# Altium schematic sheet TCAN1146_PWR_MGMT.SchDoc
size C; SheetNumber: 5; SheetTotal: 7
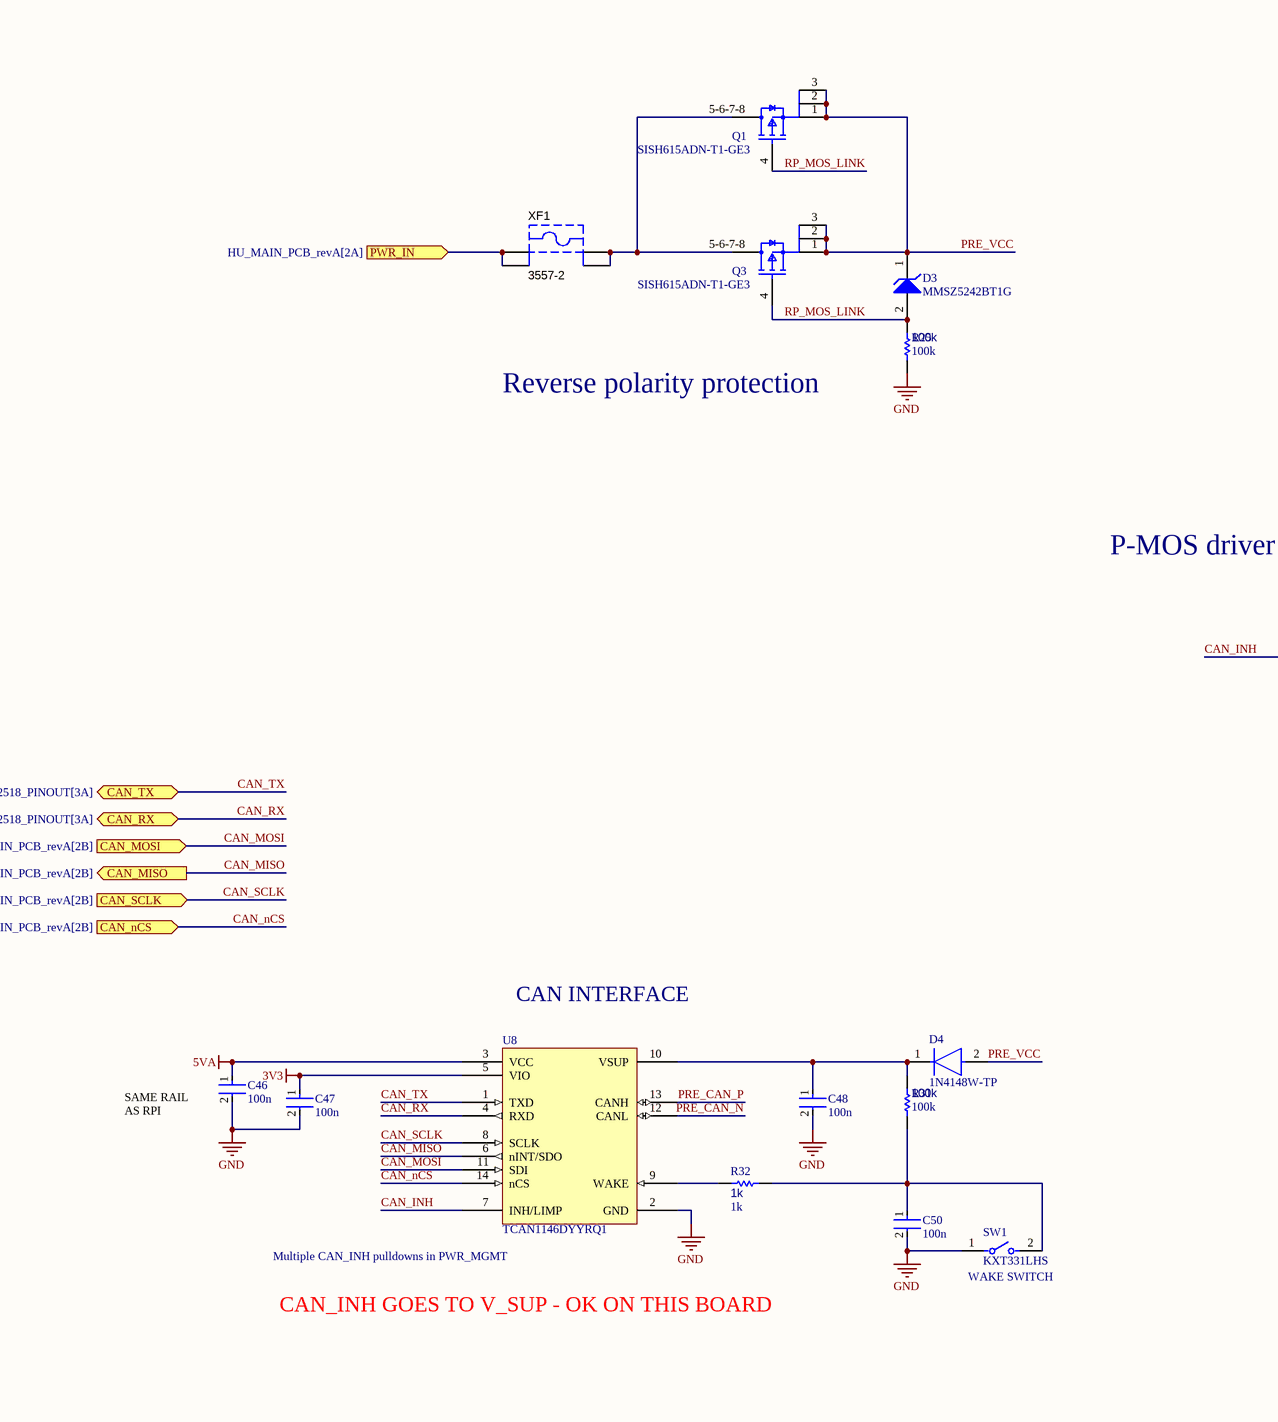
[diagram p0: TCAN1146_PWR_MGMT.SchDoc, left]
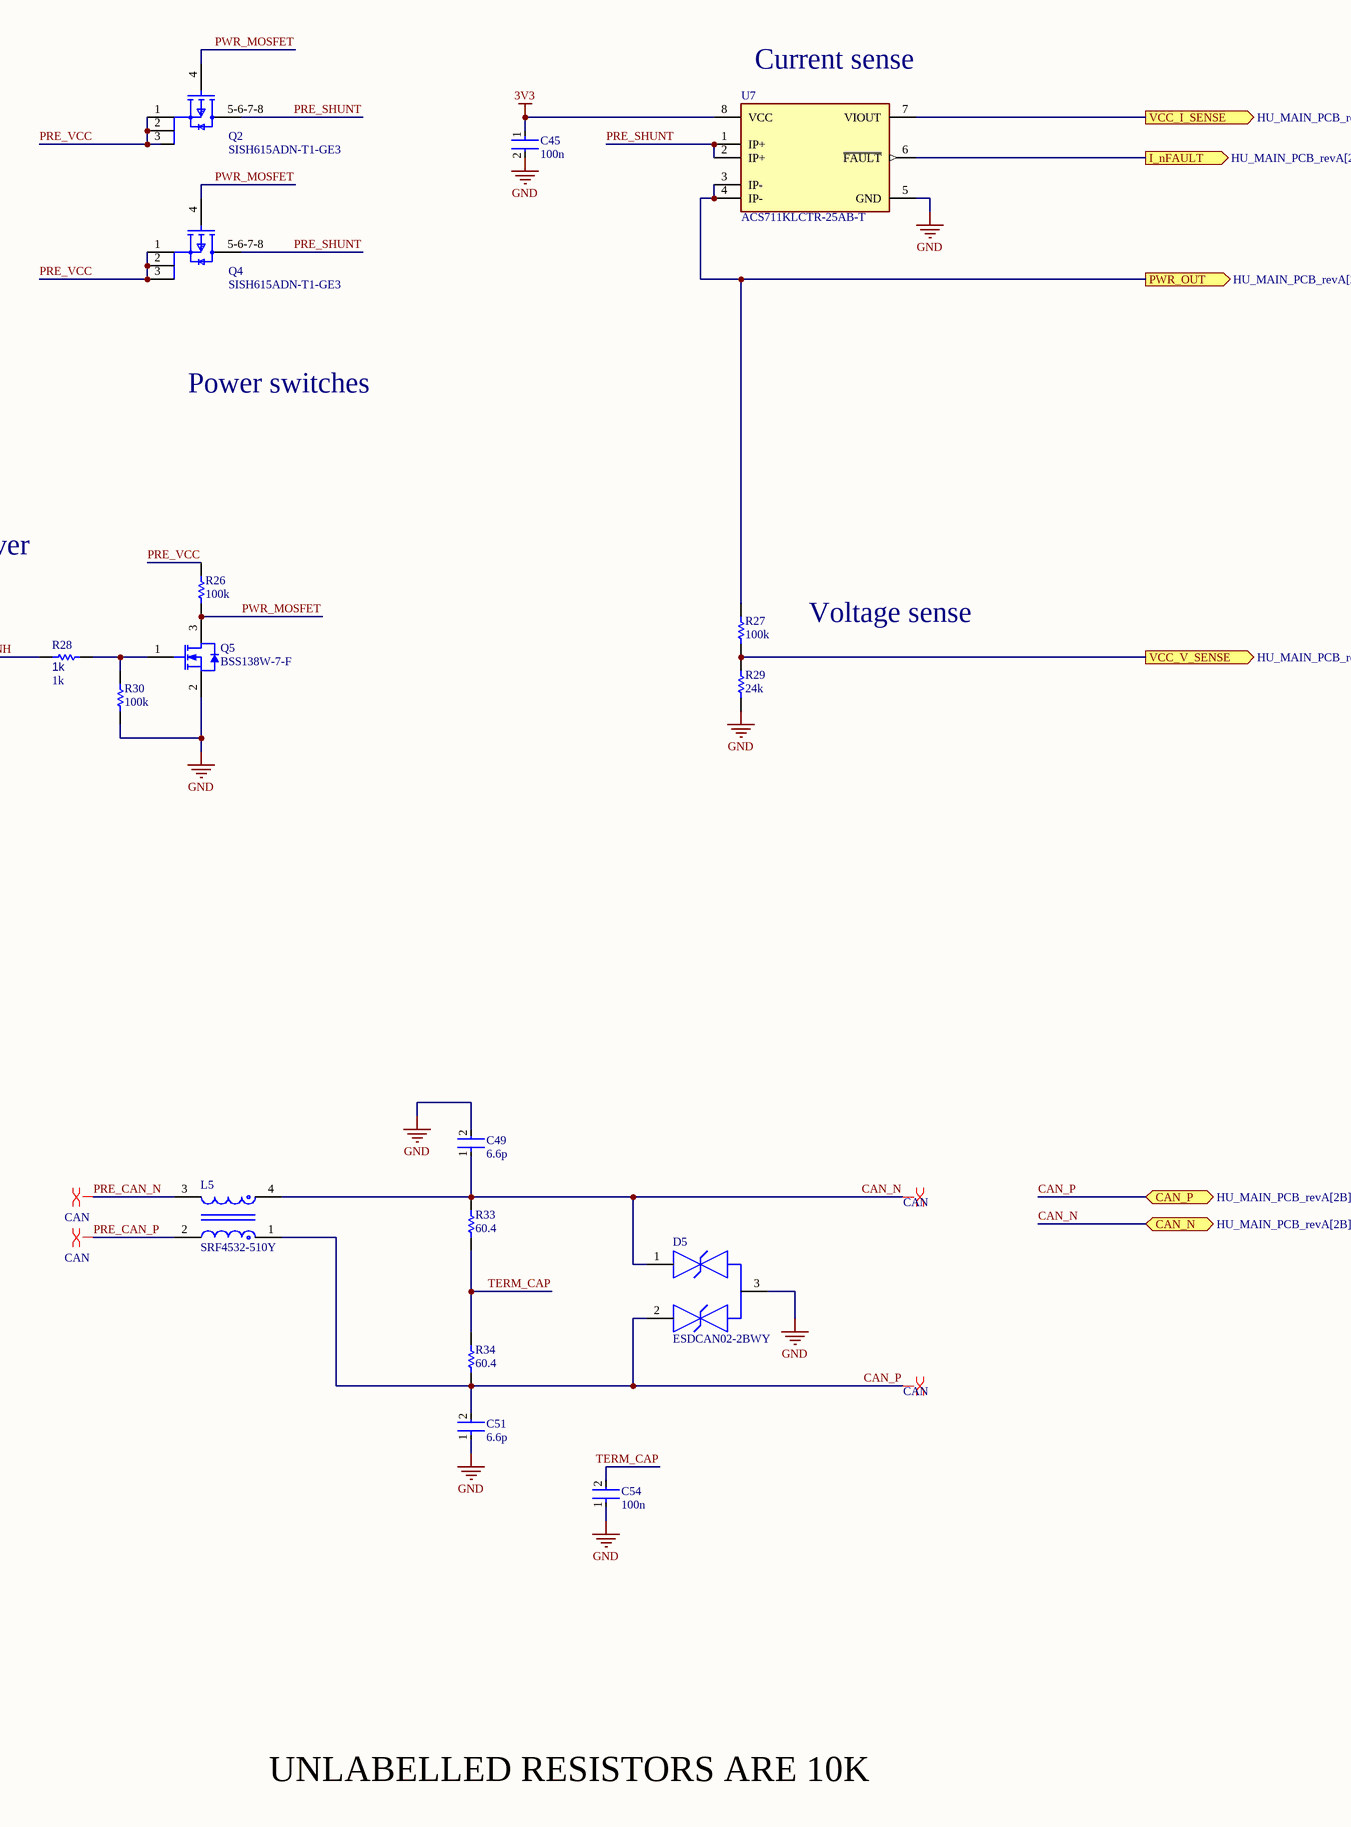
[diagram p1: TCAN1146_PWR_MGMT.SchDoc, right]

## Parts
C45  100n  [FP-0402-L_1_0_0_05-W_0_5-IPC_A]
C46  100n  [FP-0402-L_1_0_0_05-W_0_5-IPC_A]
C47  100n  [FP-0402-L_1_0_0_05-W_0_5-IPC_A]
C48  100n  [FP-0402-L_1_0_0_05-W_0_5-IPC_A]
C49  6.6p  [FP-0402-L_1_0_0_05-W_0_5-IPC_A]
C50  100n  [FP-0402-L_1_0_0_05-W_0_5-IPC_A]
C51  6.6p  [FP-0402-L_1_0_0_05-W_0_5-IPC_A]
C54  100n  [FP-0402-L_1_0_0_05-W_0_5-IPC_A]
D3  MMSZ5242BT1G  [ONSC-SOD-123-2-425-04_V]
D4  1N4148W-TP  [FP-SOD-123-IPC_A]
D5  ESDCAN02-2BWY  [FP-SOT323-3L-MFG]
L5  SRF4532-510Y  [FP-SRF4532-MFG]
Q1  SISH615ADN-T1-GE3  [SISH615ADN-T1-GE3-Footprint-1]
Q2  SISH615ADN-T1-GE3  [SISH615ADN-T1-GE3-Footprint-1]
Q3  SISH615ADN-T1-GE3  [SISH615ADN-T1-GE3-Footprint-1]
Q4  SISH615ADN-T1-GE3  [SISH615ADN-T1-GE3-Footprint-1]
Q5  BSS138W-7-F  [DIOD-SOT323-3_V]
R25  100k  [R0603B]
R26  100k  [R0603B]
R27  100k  [R0603B]
R28  1k  [R0603B]
R29  24k  [R0603B]
R30  100k  [R0603B]
R31  100k  [R0603B]
R32  1k  [R0603B]
R33  60.4  [R0603B]
R34  60.4  [R0603B]
SW1  KXT331LHS  [FP-KXT331LHS-MFG]
U7  ACS711KLCTR-25AB-T  [FP-LC-8-IPC_A]
U8  TCAN1146DYYRQ1  [TCAN1146DYYRQ1-Footprint-1]
XF1  3557-2  [KSTN-3557-2]

## Ports
CAN_MISO (out, see HU_MAIN_PCB_revA[2B]), CAN_MOSI (in, see HU_MAIN_PCB_revA[2B]), CAN_N (bidir, see HU_MAIN_PCB_revA[2B]), CAN_nCS (in, see HU_MAIN_PCB_revA[2B]), CAN_P (bidir, see HU_MAIN_PCB_revA[2B]), CAN_RX (bidir, see HU_MAIN_PCB_revA[2B], MCP2518_PINOUT[3A]), CAN_SCLK (in, see HU_MAIN_PCB_revA[2B]), CAN_TX (bidir, see HU_MAIN_PCB_revA[2B], MCP2518_PINOUT[3A]), I_nFAULT (out, see HU_MAIN_PCB_revA[2B]), PWR_IN (in, see HU_MAIN_PCB_revA[2A]), PWR_OUT (out, see HU_MAIN_PCB_revA[2A]), VCC_I_SENSE (out, see HU_MAIN_PCB_revA[2B]), VCC_V_SENSE (out, see HU_MAIN_PCB_revA[2B])

## Nets
3V3: C45.1 C47.1 U7.8(VCC) U8.5(VIO)
5VA: C46.1 U8.3(VCC)
GND: C45.2 C46.2 C47.2 C48.2 C49.2 C50.2 C51.1 C54.1 D5.3 Q5.2(S) R25.1 R29.1 R30.1 SW1.1 U7.5(GND) U8.2(GND)
CAN_INH: R28.1 U8.7(INH/LIMP)
CAN_MISO: U8.6(nINT/SDO) ; port CAN_MISO
CAN_MOSI: U8.11(SDI) ; port CAN_MOSI
CAN_N: C49.1 D5.1 L5.4 R33.2 ; port CAN_N
CAN_nCS: U8.14(nCS) ; port CAN_nCS
CAN_P: C51.2 D5.2 L5.1 R34.1 ; port CAN_P
CAN_RX: U8.4(RXD) ; port CAN_RX
CAN_SCLK: U8.8(SCLK) ; port CAN_SCLK
CAN_TX: U8.1(TXD) ; port CAN_TX
I_nFAULT: U7.6(~{FAULT}) ; port I_nFAULT
PRE_CAN_N: L5.3 U8.12(CANL)
PRE_CAN_P: L5.2 U8.13(CANH)
PRE_SHUNT: Q2.5-6-7-8(D) Q4.5-6-7-8(D) U7.1(IP+) U7.2(IP+)
PRE_VCC: D3.1(K) D4.2(A) Q1.1(S) Q1.2(S) Q1.3(S) Q2.1(S) Q2.2(S) Q2.3(S) Q3.1(S) Q3.2(S) Q3.3(S) Q4.1(S) Q4.2(S) Q4.3(S) R26.2
PWR_IN: XF1.1 XF1.2 ; port PWR_IN
PWR_MOSFET: Q2.4(G) Q4.4(G) Q5.3(D) R26.1
PWR_OUT: R27.2 U7.3(IP-) U7.4(IP-) ; port PWR_OUT
RP_MOS_LINK: D3.2(A) Q1.4(G) Q3.4(G) R25.2
TERM_CAP: C54.2 R33.1 R34.2
VCC_I_SENSE: U7.7(VIOUT) ; port VCC_I_SENSE
VCC_V_SENSE: R27.1 R29.2 ; port VCC_V_SENSE
NetC48_1: C48.1 D4.1(C) R31.2 U8.10(VSUP)
NetC50_1: C50.1 R31.1 R32.2 SW1.2
NetQ1_5-6-7-8: Q1.5-6-7-8(D) Q3.5-6-7-8(D) XF1.3 XF1.4
NetQ5_1: Q5.1(G) R28.2 R30.2
NetR32_1: R32.1 U8.9(WAKE)

## Layout directives
differential pair; differential pair class CAN: CAN_N, CAN_P, PRE_CAN_N, PRE_CAN_P

## Notes on the sheet
- (near U7) Current sense
- (near R25) Reverse polarity protection
- Power switches
- P-MOS driver
- Voltage sense
- CAN INTERFACE
- (near C46) SAME RAIL AS RPI
- (near U8) Multiple CAN_INH pulldowns in PWR_MGMT
- (near SW1) WAKE SWITCH
- CAN_INH GOES TO V_SUP - OK ON THIS BOARD
- UNLABELLED RESISTORS ARE 10K

## Library data of the parts
C45-C51 C54 = CMP-001-00058-1: LARGE PADS, 0402 CAP, CHANGE COMMENT TO MATCH REAL P/N; Capacitor Type: Ceramic; Min Operating Temperature: -55°C; Mounting Technology: Surface Mount; Pins: 2; Case/Package: 0402; RoHS Compliant: Yes; Max Operating Temperature: 85°C
D3 = CMP-1060-00565-1: Zener Voltage Regulator, 500 mW, 2-Pin SOD-123, Pb-Free, Tape and Reel; Manufacturer: On Semiconductor; P Max (W): 0.5; VZ Typ (V): 12; PartNumber: MMSZ5242BT1G; PackageReference: SOD-123-2-425-04; ComponentLink3URL: http://www.onsemi.com/pub_link/Collateral/425-04.PDF; Mounting Technology: Surface Mount; ComponentLink2Description: Datasheet; ComponentLink1URL: http://www.onsemi.com/; ComponentLink3Description: Package Specification; PackageDescription: 2-Pin SOD, Body 1.6 x 2.69 mm; PackageVersion: Rev. G, 10/2009; ComponentLink1Description: Manufacturer URL; RoHS: Pb-Free; ComponentLink2URL: http://www.onsemi.com/pub_link/Collateral/MMSZ5221BT1-D.PDF; Packing: Tape and Reel; DatasheetVersion: Rev. 12
D4 = CMP-2000-04993-2: DIODE GEN PURP 100V 150MA SOD123; Max Reverse Leakage Current: 5uA; Max Surge Current: 2A; Reverse Recovery Time: 4ns; Polarity: Standard; Capacitance: 4pF; Max Forward Surge Current (Ifsm): 1A; Element Configuration: Single; Power Dissipation: 400mW; Forward Voltage: 1V; Radiation Hardening: No; Lead Free: Lead Free; Max Reverse Voltage (DC): 100V; Current Rating: 150mA; Forward Current: 150mA; Packaging: Tape and Reel; Number of Pins: 2; Package Quantity: 3000; Max Operating Temperature: 150°C; Min Operating Temperature: -65°C; Average Rectified Current: 150mA; Recovery Time: 4ns; Output Current: 150mA; Peak Non-Repetitive Surge Current: 2A; Width: 1.8mm; Voltage Rating (DC): 100V; Height: 1.2mm; Max Repetitive Reverse Voltage (Vrrm): 100V; Mount: Surface Mount; Length: 2.85mm
D5 = CMP-12225-000055-1: TVS DIODE 26.5V 44V SOT323-3; Manufacturer: STMicroelectronics; Value: 3pF; Direction: Bidirectional; Breakdown Voltage: 28.5V; Automotive Grade: Grade 0; Standoff Height: 0mm; Peak Pulse Power: 170W; Peak Pulse Current: 3A; Number Of Channels: 2; Max Junction Temp: +175°C; Mouser Description: TVS Diodes / ESD Suppressors Automotive dual-line Transil, Transient voltage suppressor (TVS) for CAN bus; Height: 1.1mm; Category: Diode; Reverse Standoff Voltage: 26.5V; Device Class L1: Circuit Protection; Temperature: -55°C to +175°C; RoHS: TRUE; ComponentLink2URL: https://www.st.com/resource/en/datasheet/esdcan02-2bwy.pdf; Device Class L3: unset; Device Class L2: TVS Diodes; Temperature Range High: +175°C; Octopart: https://octopart.com/esdcan02-2bwy-stmicroelectronics-58631133; Ipc Land Pattern Name: SOT65P210X95-3; Temperature Range Low: -55°C; Capacitance: 3pF; Digikey Description: TVS DIODE 26.5V 44V SOT323-3; Automotive: Yes; ComponentLink2Description: Datasheet; Clamping Voltage: 44V; Manufacturer Part Number: ESDCAN02-2BWY; Lead Free: Yes; Package: SOT323-3L
L5 = CMP-07251-000006-1: CMC 51UH 200MA 2LN 2KOHM SMD; Element Configuration: Dual; Number of Lines: 2; Core Material: Ferrite; Impedance: 2kR; Test Frequency: 100kHz; Voltage Rating (DC): 50V; Insulation Resistance: 10MR; Material: Steel; Tolerance: 50%; DC Resistance (DCR): 3.5R; RoHS Compliant: Yes; Mount: Surface Mount; REACH SVHC: No SVHC; Termination: SMD/SMT; DC Current: 200mA; Current: 200mA; Lead Free: Lead Free; Contact Plating: Tin; Length: 4.5mm; Max DC Current: 200mA; Width: 0.126inch; Case/Package: 4532; Packaging: Tape and Reel; Package Quantity: 1; Min Operating Temperature: -40°C; Depth: 3.4mm; Series: SRF4532; Max Operating Temperature: 125°C; Current Rating: 200mA; Self Resonant Frequency: 100kHz; Height: 0.118inch; Inductance: 51uH; Resistance: 2kR
Q1-Q4 = CMP-013-00018-2: Trans MOSFET P-CH 20V 22.1A 8-Pin PowerPAK 1212 EP T/R; Source: SISH615ADN-T1-GE3.SchLib; Design Item ID: CMP-013-00036-4; Component Type: Standard; Pins: 5
Q5 = CMP-2000-05968-1: N-Channel Enhancement Mode Mosfet, 50 V, 200 mA, -55 to 150 degC, 6-Pin SOT-323, RoHS, Tape and Reel; Typical Turn-Off Delay Time: 20ns; Number of Channels: 1Channel; Type: EnhancementModeFieldEffectTransistor; Brand: DiodesIncorporated; Vds - Drain-Source Breakdown Voltage: 75V; Vgs - Gate-Source Voltage: 20V; Rds On - Drain-Source Resistance: 1.4Ohms; Transistor Type: 1N-Channel; Configuration: Single; Unit Weight: 0.000212oz; Pd - Power Dissipation: 200mW; Id - Continuous Drain Current: 200mA; Forward Transconductance - Min: 0.1S; Manufacturer URL: http://www.diodes.com/; Series: BSS138; Package Description: 3-Pin Small Outline Transistor, Body 2 x 1.25 mm, Pitch 0.65 mm; Mounting Technology: SurfaceMount; Product Category: MOSFET; RoHS: True; Maximum Operating Temperature: +150C; Height: 1mm; Length: 2.2mm; Technology: Si; Width: 1.35mm; Datasheet URL: http://www.diodes.com/_files/datasheets/ds30206.pdf; Manufacturer: DiodesIncorporated; Package / Case: SOT-323-3; Typical Turn-On Delay Time: 20ns; Transistor Polarity: N-Channel; Factory Pack Quantity: 3000; Packaging: Reel; Product: MOSFETSmallSignal; Datasheet Version: Rev. 11-2, 09/2013; Package Reference: SOT323; Minimum Operating Temperature: -55C; Mounting Style: SMD/SMT; Channel Mode: Enhancement
R25-R34 = CMP-009-00002-14: Resistor
  R25-R27 R30 R31: Value: 100k
  R28 R32: Value: 1k
  R29: Value: 24k
  R33 R34: Value: 60.4
SW1 = CMP-10040-000029-1: SWITCH TACTILE SPST-NO 0.02A 15V; Operating Force: 240gf; Switch Travel: 0.13mm; Illumination Type: Non-Illuminated; Throw Configuration: SPST; Number of Ports: 1; Current Rating: 5A; Mechanical Life: 500000Cycles; Switch Function: Off-Mom; Connector Type: USB; Actuator Type: Standard; Gender: Receptacle; Number of Contacts: 24; Contact Plating: Gold; Insulation Color: Black; Min Operating Temperature: -40°C; Packaging: Tape and Reel; Flammability Rating: UL94 V-0; Max Operating Temperature: 85°C; Termination: Solder; Mount: Surface Mount
U7 = CMP-1557-00015-2: SENSOR CURRENT HALL 25A AC/DC; Bandwidth: 100kHz; Min Supply Voltage: 3V; Polarity: Bidirectional; Max Supply Voltage: 5.5V; Max Supply Current: 5.5mA; Number of Channels: 1; Quiescent Current: 4mA; Sensitivity: 55mV/A; Accuracy: 4%; Linearity: 1%; Operating Supply Voltage: 3.3V; Response Time: 4.6us; Case/Package: SOIC; Min Operating Temperature: -40°C; RoHS Compliant: Yes; Length: 4.9mm; Package Quantity: 1; Number of Pins: 8; Width: 3.9mm; REACH SVHC: No SVHC; -3db Bandwidth: 100kHz; Series: -; Packaging: Tape and Reel; Max Operating Temperature: 125°C; Current Sensing: 25A; Height: 1.5mm; Frequency: 100kHz
U8 = CMP-318-000000-2: Automotive CAN FD transceiver with watchdog, bus diagnostics and partial networking via sele 14-SOT-23-THIN -40 to 150; Component Type: Standard; Design Item ID: CMP-015-00012-2; Pin Count: 14; Source: TCAN1146DYYRQ1.SchLib
XF1 = CMP-2000-05461-1: FUSE HOLDER, PCB MOUNT, 500VAC, 20A, ROHS; Manufacturer: Keystone-Electronics; Number of Circuits: 1; Voltage: 500V; Fuseholder Type: Block; Fuse Type: Blade; Fuse Size: 0.43"Lx0.15"Wx0.64"H(10.92mmx3.81mmx16.25mm); For Use With/Related Products: ATC,ATO257,MINI897; Current Rating: 30A; Datasheet URL: http://datasheet.octopart.com/3557-2-Keystone-datasheet-15715937.pdf; Orientation: Vertical; Family: Fuseholders; Datasheet Version: Apr-13; Contact Finish: TinNickel; Mounting Type: PCB; Series: -; Category: CircuitProtection; Termination Style: PCPin; Contact Material: Brass; Manufacturer URL: http://www.keyelco.com/